# EAGLE design sensor ir (EAGLE 9.6.2)
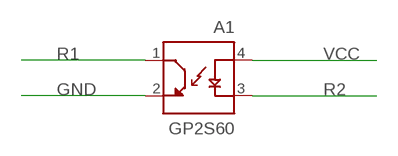
[diagram p0: schematic, sheet 1]

## Parts
A1  GP2S60  [XDCR_GP2S60]

## Nets
GND: A1.2(ET)
R1: A1.1(CT)
R2: A1.3(C)
VCC: A1.4(A)

## Library data of the parts
A1 = GP2S60:GP2S60: Reflective Optical Sensor 0.028" (0.7mm) 4-SMD, No Lead; DESCRIPTION: Reflective Optical Sensor 0.028 (0.7mm) 4-SMD, No Lead; DIGI-KEY_PART_NUMBER: 1855-1049-2-ND; MF: Sharp Microelectronics; MP: GP2S60; PACKAGE: SMD-4 Sharp Microelectronics; PURCHASE-URL: https://pricing.snapeda.com/search/part/GP2S60/?ref=eda

## Board
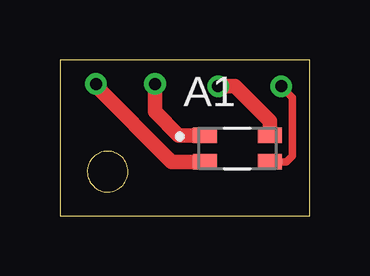
[diagram p1: board, top side]

Size 10.42 x 6.5 mm. Coordinates in mm from the lower left corner, seen from the top.
Outline: 2.52,2.5 arc180 1.46,1.18 arc180 2.52,2.5
Outline: 0,6.5 0,0 10.42,0 10.42,6.5 0,6.5
Copper layers (1*16): Top 0.035mm / dielectric 1.5mm / Bottom 0.035mm
Design rules "default *": minimum track width 6mil, minimum drill 0.35mm, track to track 6mil, track to pad 6mil, pad to pad 6mil, via to via 6mil, smd to smd 0mil, copper to edge 20mil, drill to drill 6mil, minimum pad ring 10mil, minimum via ring 8mil, stop-mask expansion 4mil, vias tented up to drill 0mil, thermal gap 10mil

### Footprints (pad centres in the part's own frame; a part is rotated, then mirrored left to right if it is on the bottom)
XDCR_GP2S60 = smd 1 x 0.65: 1 -1.35,0.55; 2 -1.35,-0.55; 3 1.35,-0.55; 4 1.35,0.55

### Placement (x,y rotation side)
A1  7.4,2.8 0 top

### Tracks (layer width: path | path; a pad name or v marks a point on that pad's centre or on a via)
GND  (via drill 0.5)
  Top 0.61: v1.5,5.5 1.5,5.4 4.65,2.25 A1.2
R1  (via drill 0.5)
  Top 0.61: v3.97,5.5 3.97,4.33 4.95,3.35 A1.1
R2  (via drill 0.5)
  Top 0.305: A1.3 9.45,2.25 9.7,2.5 9.7,4.93 v9.23,5.4
VCC  (via drill 0.5)
  Top 0.61: v6.6,5.4 7.3,5.4 8.75,3.95 A1.4